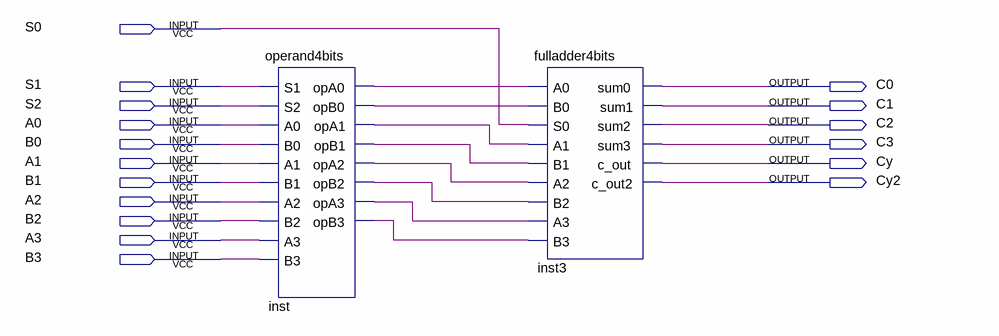
[diagram p0: schematic sheet]
// Quartus schematic AC4bits.bdf as structural Verilog: 2 symbols, 17 pins
module AC4bits (
  input  S0,
  input  S1,
  input  S2,
  input  A0,
  input  B0,
  input  A1,
  input  B1,
  input  A2,
  input  B2,
  input  A3,
  input  B3,
  output C0,
  output C1,
  output C2,
  output C3,
  output Cy,
  output Cy2
);

  wire inst_opa0, inst_opa1, inst_opa2, inst_opa3, inst_opb0, inst_opb1, inst_opb2, inst_opb3;

  operand4bits inst (
    .S1(S1), .S2(S2), .A0(A0), .B0(B0), .A1(A1), .B1(B1), .A2(A2), .B2(B2), .A3(A3), .B3(B3),
    .opA0(inst_opa0), .opB0(inst_opb0), .opA1(inst_opa1), .opB1(inst_opb1), .opA2(inst_opa2),
    .opB2(inst_opb2), .opA3(inst_opa3), .opB3(inst_opb3));
  fulladder4bits inst3 (
    .A0(inst_opa0), .B0(inst_opb0), .S0(S0), .A1(inst_opa1), .B1(inst_opb1), .A2(inst_opa2), .B2(inst_opb2),
    .A3(inst_opa3), .B3(inst_opb3), .sum0(C0), .sum1(C1), .sum2(C2), .sum3(C3), .c_out(Cy), .c_out2(Cy2));
endmodule
